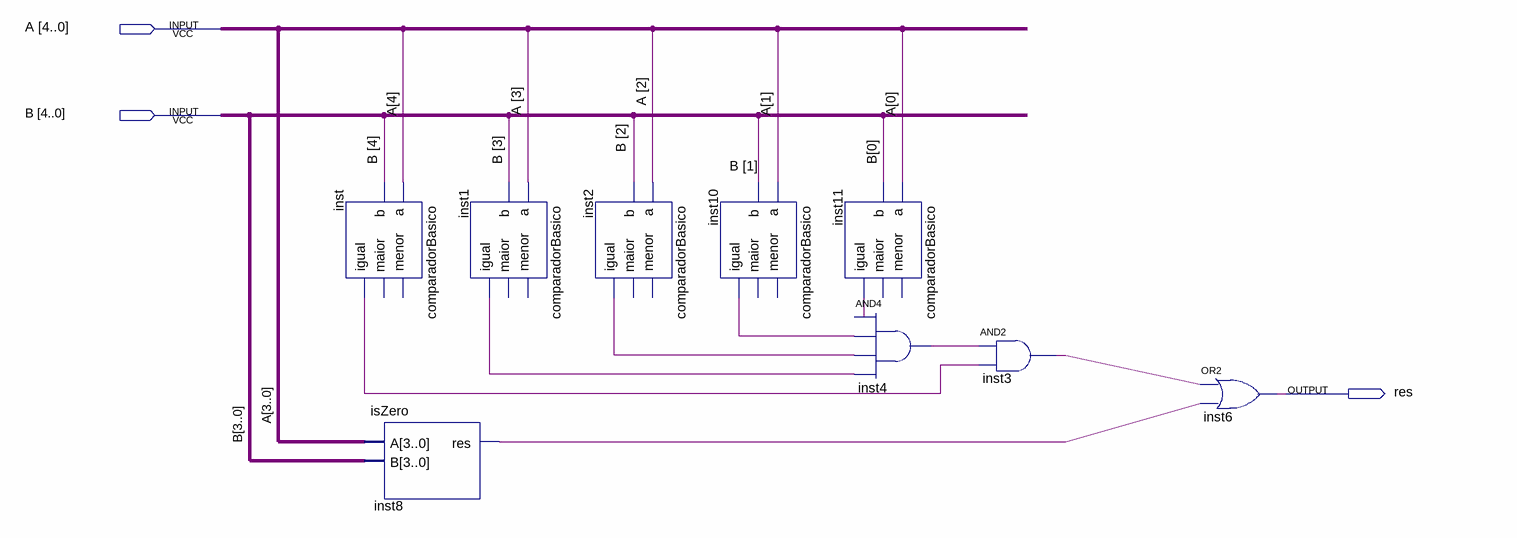
[diagram p0: schematic sheet]
// Quartus schematic igual.bdf as structural Verilog: 9 symbols, 3 pins
module igual (
  input  [4:0] A,
  input  [4:0] B,
  output res
);

  wire inst1_igual, inst2_igual, inst3_out, inst4_out, inst8_res, inst10_igual, inst11_igual, inst_igual;

  comparadorBasico inst (.a(A[4]), .b(B[4]), .igual(inst_igual));  // open: menor, maior
  isZero inst8 (.A(A[3:0]), .B(B[3:0]), .res(inst8_res));
  comparadorBasico inst1 (.a(A[3]), .b(B[3]), .igual(inst1_igual));  // open: menor, maior
  comparadorBasico inst2 (.a(A[2]), .b(B[2]), .igual(inst2_igual));  // open: menor, maior
  comparadorBasico inst10 (.a(A[1]), .b(B[1]), .igual(inst10_igual));  // open: menor, maior
  comparadorBasico inst11 (.a(A[0]), .b(B[0]), .igual(inst11_igual));  // open: menor, maior
  and inst4 (inst4_out, inst11_igual, inst10_igual, inst2_igual, inst1_igual);
  and inst3 (inst3_out, inst4_out, inst_igual);
  or inst6 (res, inst3_out, inst8_res);
endmodule
